# Altium schematic sheet MY_beamControl_R_风扇供电接口.SchDoc
size A4
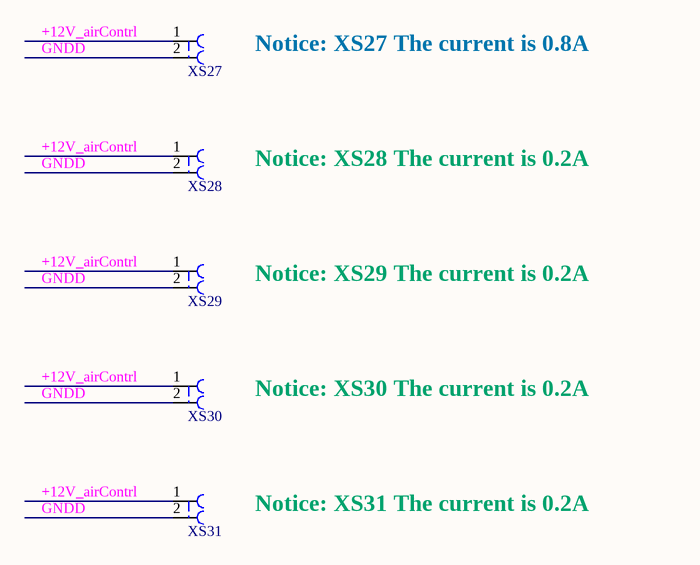
[diagram p0: MY_beamControl_R_风扇供电接口.SchDoc]

## Parts
XS27  PAD2_3mm/NC  [PAD2_3mm]  (value not drawn)
XS28  PAD2_2mm/NC  [PAD2_2mm]  (value not drawn)
XS29  PAD2_2mm/NC  [PAD2_2mm]  (value not drawn)
XS30  PAD2_2mm/NC  [PAD2_2mm]  (value not drawn)
XS31  PAD2_2mm/NC  [PAD2_2mm]  (value not drawn)

## Nets
+12V_airContrl: XS27.1 XS28.1 XS29.1 XS30.1 XS31.1
GNDD: XS27.2 XS28.2 XS29.2 XS30.2 XS31.2

## Notes on the sheet
- (near XS27) Notice: XS27 The current is 0.8A
- (near XS28) Notice: XS28 The current is 0.2A
- (near XS29) Notice: XS29 The current is 0.2A
- (near XS30) Notice: XS30 The current is 0.2A
- (near XS31) Notice: XS31 The current is 0.2A

## Library data of the parts
XS27-XS31 = 2PIN